# EasyEDA Pro project wireless-display-design.epro

# Schematic Wireless Tiny Display
Board Name: Board1; Create Date: 2025-10-23; Page Name: P1; Project Name: New Project_2025-10-23_18-24-38; Schematic Name: Wireless Tiny Display; Update Date: 2025-10-30; Company: EasyEDA.com; Page Size: A4; Version: V1.0
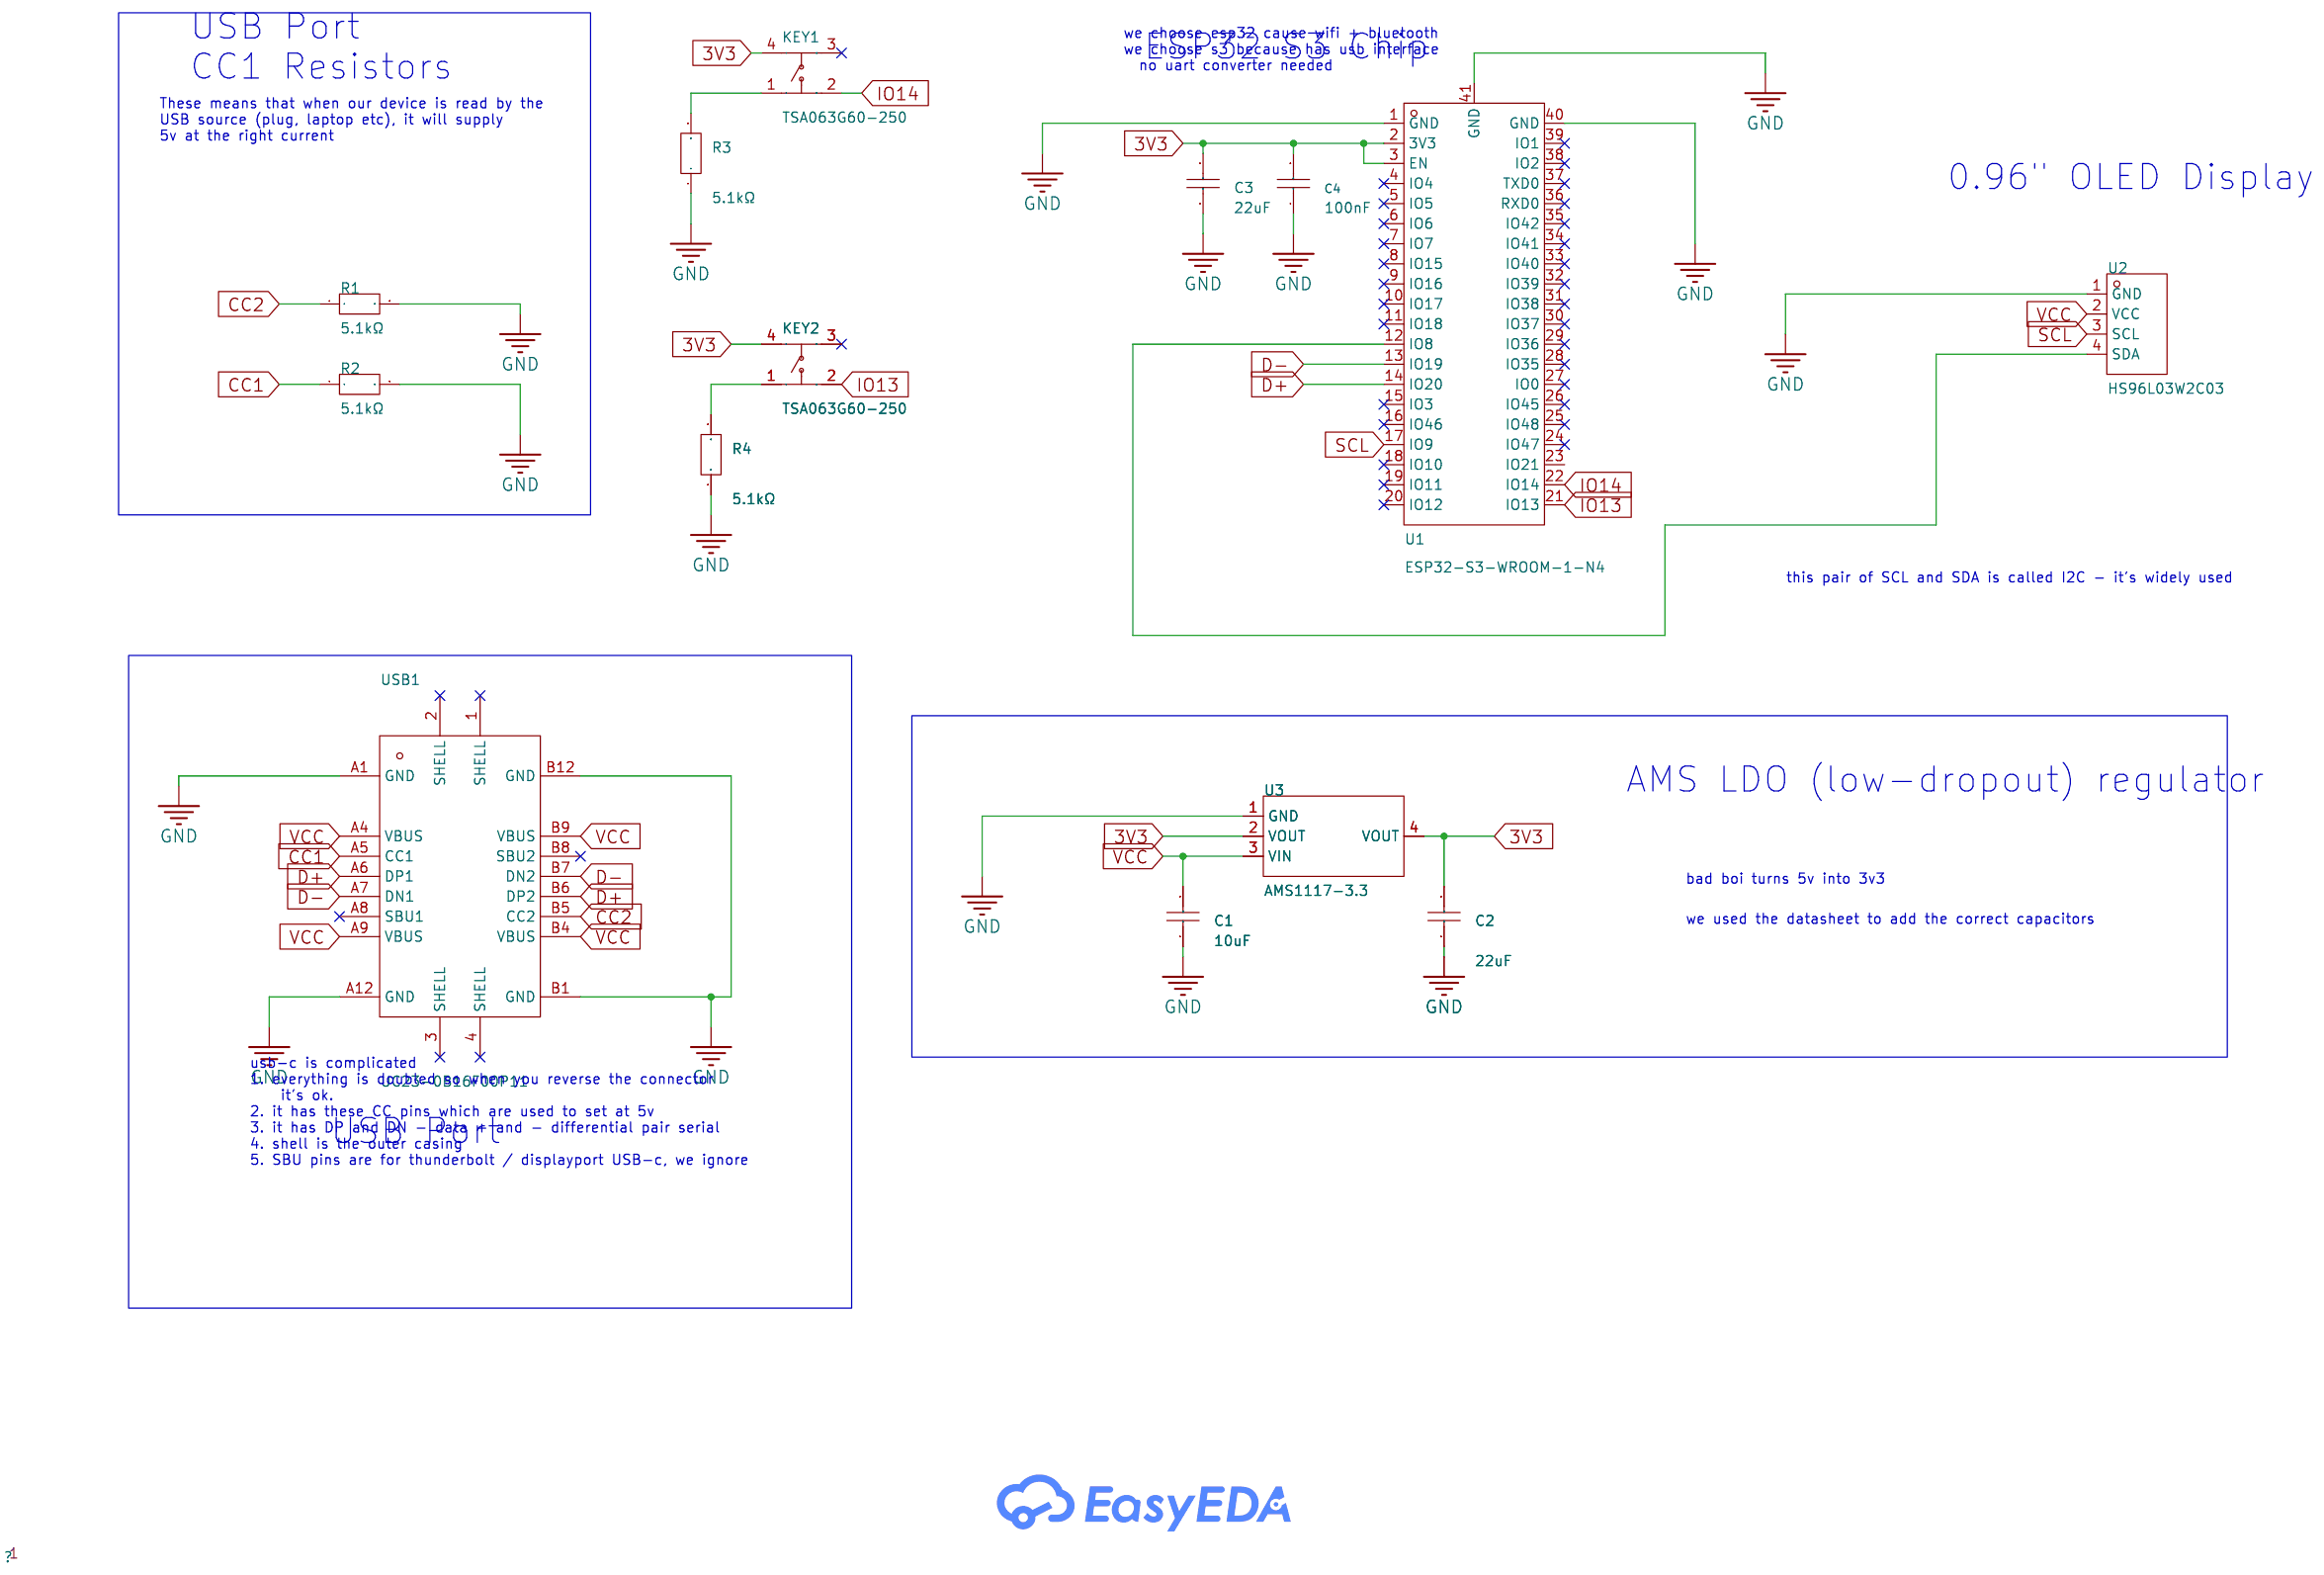
[diagram p0: schematic sheet]

## Parts
C1  10uF  [C1206]
C2  22uF  [C1206]
C3  22uF  [C1206]
C4  100nF  [C1206]
KEY1  TSA063G60-250  [KEY-SMD_4P-L6.1-W6.1-P4.50-LS9.0]
KEY2  TSA063G60-250  [KEY-SMD_4P-L6.1-W6.1-P4.50-LS9.0]
R1  5.1kΩ  [R1206]
R2  5.1kΩ  [R1206]
R3  5.1kΩ  [R1206]
R4  5.1kΩ  [R1206]
U1  ESP32-S3-WROOM-1-N4  [WIFIM-SMD_ESP32-S3-WROOM-1-N8]
U2  HS96L03W2C03  [OLED-TH_L27.8-W27.2-P2.54_C9900033791]
U3  AMS1117-3.3  [SOT-223-3_L6.5-W3.4-P2.30-LS7.0-BR]
USB1  UC23-0B16F00P11  [USB-C-TH_UC23-0B16F00P11]

## Library data of the parts
C1 = CL31A106KBHNNNE: Capacitance:10uF Tolerance:±10% Tolerance:±10% Voltage Rating:50V Temperature Coefficient:X5R; LCSC Part Name: 10uF ±10% 50V; Supplier Part: C13585; Manufacturer: SAMSUNG(三星); Supplier Footprint: 1206; JLCPCB Part Class: Basic Part; Datasheet: https://item.szlcsc.com/datasheet/CL31A106KBHNNNE/14236.html; Supplier: LCSC; Tolerance: ±10%; Voltage Rating: 50V; Temperature Coefficient: X5R
C2 C3 = CL31A226KAHNNNE: Capacitance:22uF Tolerance:±10% Tolerance:±10% Voltage Rating:25V Temperature Coefficient:X5R; LCSC Part Name: 22uF ±10% 25V; Supplier Part: C12891; Manufacturer: SAMSUNG(三星); Supplier Footprint: 1206; JLCPCB Part Class: Basic Part; Datasheet: https://item.szlcsc.com/datasheet/CL31A226KAHNNNE/13537.html; Supplier: LCSC; Tolerance: ±10%; Voltage Rating: 25V; Temperature Coefficient: X5R
C4 = CL31B104KBCNNNC: Capacitance:100nF Tolerance:±10% Tolerance:±10% Voltage Rating:50V Temperature Coefficient:X7R; LCSC Part Name: 100nF ±10% 50V; Supplier Part: C24497; Manufacturer: SAMSUNG(三星); Supplier Footprint: 1206; JLCPCB Part Class: Basic Part; Datasheet: https://item.szlcsc.com/datasheet/CL31B104KBCNNNC/25237.html; Supplier: LCSC; Tolerance: ±10%; Voltage Rating: 50V; Temperature Coefficient: X7R
KEY1 KEY2 = TSA063G60-250: Circuit:SPST Actuator Style:Round Button Operating Force:2.5N Mounting Type:Surface Mount,Vertical Length:6.1mm Width:6.1mm Switch Height:6mm with Bracket:Without Bracket Contact Current:50mA Voltage Rating:12V Actuator/Cap Color:Black With Lamp:No Termin; LCSC Part Name: 6.1*6.1*6mm 立贴 轻触开关; Supplier Part: C294566; Manufacturer: BRIGHT(博瑞泰); Supplier Footprint: SMD; JLCPCB Part Class: Extended Part; Datasheet: https://item.szlcsc.com/datasheet/TSA063G60-250/279063.html; Supplier: LCSC; Circuit: SPST; Actuator Style: Round Button; Operating Force: 2.5N; Mounting Type: Surface Mount,Vertical; Length: 6.1mm; Width: 6.1mm; Switch Height: 6mm; with Bracket: Without Bracket; Contact Current: 50mA; Voltage Rating: 12V; Actuator/Cap Color: Black; With Lamp: No; Termination Style: Gull Wing; Life: 50,000 Cycles; Operating Temperature: -25℃~+70℃
R1-R4 = FRC1206J512 TS: Type:Thick Film Resistor Resistance:5.1kΩ Tolerance:±5% Tolerance:±5% Power(Watts):250mW Voltage-Supply(Max):200V Temperature Coefficient:±100ppm/℃ Temperature Coefficient:±100ppm/℃ Operating Temperature:-55℃~+155℃ Operating Temperature:-55℃~+155℃; LCSC Part Name: 5.1kΩ ±5% 250mW 厚膜电阻; Supplier Part: C2907509; Manufacturer: FOJAN(富捷); Supplier Footprint: 1206; Supplier: LCSC; Type: Thick Film Resistor; Tolerance: ±5%; Power(Watts): 250mW; Voltage-Supply(Max): 200V; Temperature Coefficient: ±100ppm/℃; Operating Temperature: -55℃~+155℃
U1 = ESP32-S3-WROOM-1-N4: LCSC Part Name: 通用型Wi-Fi+低功耗蓝牙MCU模组; Supplier Part: C2913197; Manufacturer: ESPRESSIF(乐鑫); Supplier Footprint: SMD,18x25.5mm; JLCPCB Part Class: Extended Part; Datasheet: https://item.szlcsc.com/datasheet/ESP32-S3-WROOM-1-N4/3198295.html; Supplier: LCSC
U2 = HS96L03W2C03: Main Control Chip:SSD1315 Interface Type:I2C Size:0.96 Pixel Resolution:128x64 Operating Temperature:-40℃~+70℃ Operating Temperature:-40℃~+70℃; LCSC Part Name: 0.96寸OLED显示屏窄白光IIC; Supplier Part: C5248080; Manufacturer: HS(汉昇); JLCPCB Part Class: Extended Part; Datasheet: https://atta.szlcsc.com/upload/public/pdf/source/20230627/763D01F79A90007632F098068C7C8AD9.pdf; Supplier: LCSC; Main Control Chip: SSD1315; Interface Type: I2C; Size: 0.96; Pixel Resolution: 128x64; Operating Temperature: -40℃~+70℃
U3 = AMS1117-3.3_C6186: Output Type:Fixed Voltage - Supply:16V Output Voltage:3.3V Output Voltage:3.3V Output Current:1A Power Supply Rejection Ratio (PSRR):72dB@(120Hz) Voltage Dropout:1.1V@(800mA) standby current:5mA Noise:0.003%Vout Features:Over Current Protection；Over Tempe; LCSC Part Name: 输出3.3V 1A; Supplier Part: C6186; Manufacturer: AMS; Supplier Footprint: SOT-223; Datasheet: https://item.szlcsc.com/datasheet/AMS1117-3.3/6652.html; Supplier: LCSC; Output Type: Fixed; Voltage - Supply: 16V; Output Voltage: 3.3V; Output Current: 1A; Power Supply Rejection Ratio (PSRR): 72dB@(120Hz); Voltage Dropout: 1.1V@(800mA); standby current: 5mA; Noise: 0.003%Vout; Features: Over Current Protection；Over Temperature Protection; Operating Temperature: -40℃~+125℃; Output Configuration: Positive; Number of Outputs: 1
USB1 = UC23-0B16F00P11: Connector Type:Type-C Gender:Female Mounting Type:Right Angle Number of Contacts:16P Number of Ports:1 Operating Temperature:-45℃~+85℃ Operating Temperature:-45℃~+85℃; LCSC Part Name: USB Type-C 母座 弯插; Supplier Part: C36936564; Manufacturer: BXCONN(宝讯); Supplier Footprint: 弯插; JLCPCB Part Class: Extended Part; Datasheet: https://item.szlcsc.com/datasheet/UC23-0B16F00P11/38663640.html; Supplier: LCSC; Connector Type: Type-C; Gender: Female; Mounting Type: Right Angle; Number of Contacts: 16P; Number of Ports: 1; Operating Temperature: -45℃~+85℃

## Nets
3V3: C2.2 C3.2 C4.2 KEY1.4 KEY2.4 U1.2(3V3) U1.3(EN) U3.2(VOUT) U3.4(VOUT)
GND: C1.1 C2.1 C3.1 C4.1 R1.2 R2.2 R3.1 R4.1 U1.1(GND) U1.40(GND) U1.41(GND) U2.1(GND) U3.1(GND) USB1.A1(GND) USB1.A12(GND) USB1.B1(GND) USB1.B12(GND)
VCC: C1.2 U2.2(VCC) U3.3(VIN) USB1.A4(VBUS) USB1.A9(VBUS) USB1.B4(VBUS) USB1.B9(VBUS)
CC1: R2.1 USB1.A5(CC1)
CC2: R1.1 USB1.B5(CC2)
D+: U1.14(IO20) USB1.A6(DP1) USB1.B6(DP2)
D-: U1.13(IO19) USB1.A7(DN1) USB1.B7(DN2)
IO13: KEY2.2 U1.21(IO13)
IO14: KEY1.2 U1.22(IO14)
SCL: U1.17(IO9) U2.3(SCL)
$1N3352: U1.12(IO8) U2.4(SDA)
$1N4443: KEY1.1 R3.2
$1N4682: KEY2.1 R4.2

Not connected (* = marked no-connect by the designer): KEY1 3*; KEY2 3*; U1 4(IO4)* 5(IO5)* 6(IO6)* 7(IO7)* 8(IO15)* 9(IO16)* 10(IO17)* 11(IO18)* 15(IO3)* 16(IO46)* 18(IO10)* 19(IO11)* 20(IO12)* 23(IO21) 24(IO47)* 25(IO48)* 26(IO45)* 27(IO0)* 28(IO35)* 29(IO36)* 30(IO37)* 31(IO38)* 32(IO39)* 33(IO40)* 34(IO41)* 35(IO42)* 36(RXD0)* 37(TXD0)* 38(IO2)* 39(IO1)*; USB1 1(SHELL)* 2(SHELL)* 3(SHELL)* 4(SHELL)* A8(SBU1)* B8(SBU2)*

## Notes on the sheet
- ESP32 S3 Chip
- USB Port
  CC1 Resistors
- we choose esp32 cause wifi + bluetooth
  we choose s3 because has usb interface
    no uart converter needed
- These means that when our device is read by the
  USB source (plug, laptop etc), it will supply
  5v at the right current
- 0.96" OLED Display
- this pair of SCL and SDA is called I2C - it's widely used
- AMS LDO (low-dropout) regulator
- bad boi turns 5v into 3v3
- we used the datasheet to add the correct capacitors
- USB Port
- usb-c is complicated
  1. everything is doubled so when you reverse the connector
      it's ok.
  2. it has these CC pins which are used to set at 5v
  3. it has DP and DN - data + and - differential pair serial
  4. shell is the outer casing
  5. SBU pins are for thunderbolt / displayport USB-c, we ignore

# Board PCB2
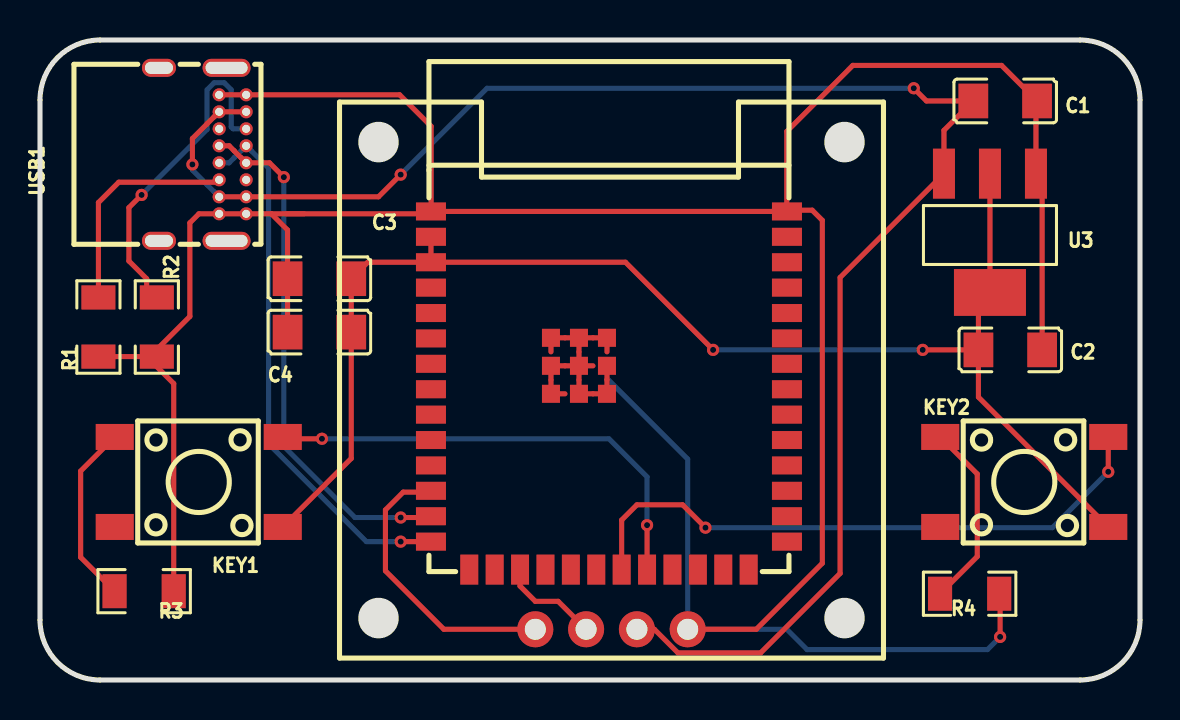
[diagram p1: board, top side]
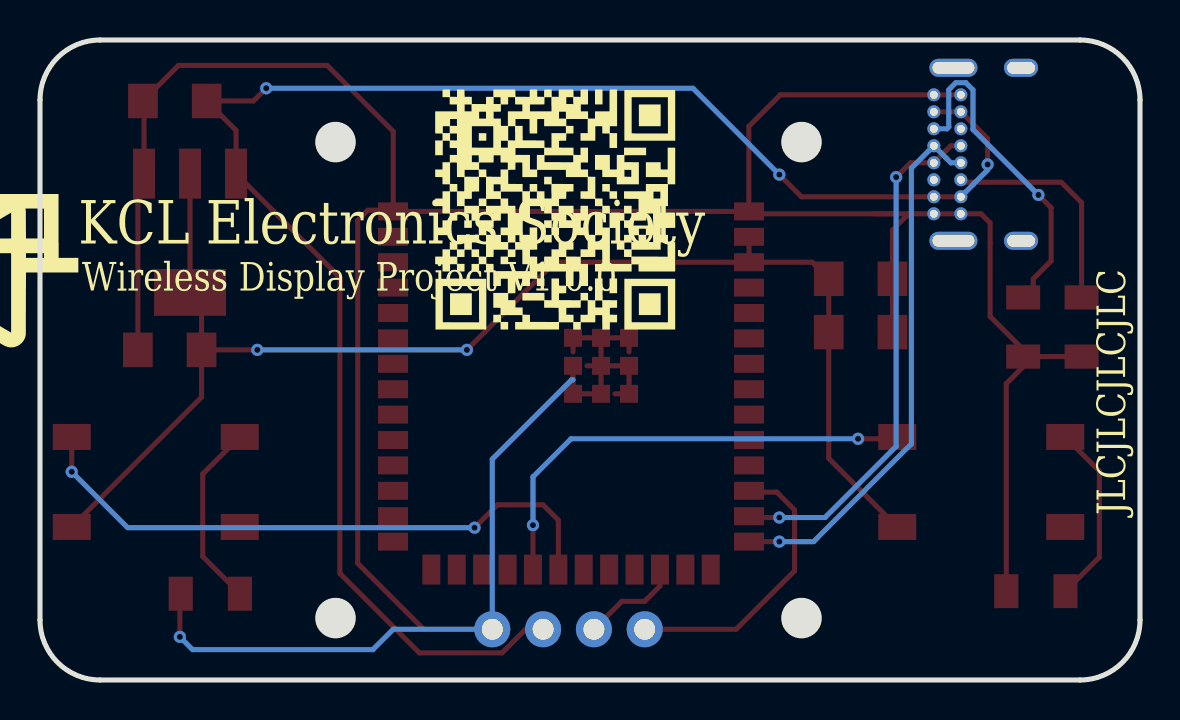
[diagram p2: board, bottom side, seen from below]

Outline 55 x 32 mm; copper layers: Top Layer, Bottom Layer. Coordinates in mm from the lower left corner of the outline.
Outline path: 0,29 0,3 arc(0.88,0.88) 3,0 52,0 arc(54.12,0.88) 55,3 55,29 arc(54.12,31.12) 52,32 3,32 arc(0.88,31.12) 0,29
Stack: Top Layer 0.035mm / Dielectric1 1.51mm FR4 er 4.5 / Bottom Layer 0.035mm

## Design rules (mm)
template: JLCPCB Capability(Two Layers Board)
spacing copperThickness1oz (default): track to track 0.102, other pairs 0.152 to 0.3
spacing copperThickness2oz: track to track 0.203, other pairs 0.152 to 0.3
track width copperThickness1oz (default): min 0.127, default 0.254, max 2.54
track width copperThickness2oz: min 0.203, default 0.254, max 2.54
differential pair differentialPair (default): width min 0.127, default 0.254, max 2.54; gap min 0.152, default 0.152
via viaSize (default): diameter min 0.5, default 0.61, max 10; hole min 0.3, default 0.305, max 6.3

## Placement (name value [footprint] x y rotation side)
C1  10uF  [C1206]  48.26 28.95 180 top
C2  22uF  [C1206]  48.51 16.51 180 top
C3  22uF  [C1206]  13.97 20.06 0 top
C4  100nF  [C1206]  13.97 17.39 0 top
KEY1  TSA063G60-250  [KEY-SMD_4P-L6.1-W6.1-P4.50-LS9.0]  7.94 9.9 0 top
KEY2  TSA063G60-250  [KEY-SMD_4P-L6.1-W6.1-P4.50-LS9.0]  49.21 9.9 0 top
R1  5.1kΩ  [R1206]  2.92 17.65 270 top
R2  5.1kΩ  [R1206]  5.84 17.65 270 top
R3  5.1kΩ  [R1206]  5.21 4.44 180 top
R4  5.1kΩ  [R1206]  46.48 4.31 180 top
U1  ESP32-S3-WROOM-1-N4  [WIFIM-SMD_ESP32-S3-WROOM-1-N8]  28.45 14.47 0 top
U2  HS96L03W2C03  [OLED-TH_L27.8-W27.2-P2.54_C9900033791]  28.58 2.54 180 top
U3  AMS1117-3.3  [SOT-223-3_L6.5-W3.4-P2.30-LS7.0-BR]  47.5 22.35 90 top
USB1  UC23-0B16F00P11  [USB-C-TH_UC23-0B16F00P11]  8.13 26.28 270 top

## Footprints (pads in the part's own frame, mm; a bottom-side part is the same pattern mirrored in y, then rotated)
C1206
  rect 1.485x1.728 smd: 1(-1.593,0) 2(1.593,0)
KEY-SMD_4P-L6.1-W6.1-P4.50-LS9.0
  rect 1.9x1.3 smd: 1(-4.2,2.25) 2(4.2,2.25) 3(-4.2,-2.25) 4(4.2,-2.25)
OLED-TH_L27.8-W27.2-P2.54_C9900033791
  round 1.8 hole 1.05: 1(-3.81,0) 2(-1.27,0) 3(1.27,0) 4(3.81,0)
R1206
  rect 1.208x1.701 smd: 1(-1.479,0) 2(1.479,0)
SOT-223-3_L6.5-W3.4-P2.30-LS7.0-BR
  rect 2.5x1.1 smd: 1(2.97,-2.3) 2(2.97,0) 3(2.97,2.3)
  rect 2.34x3.6 smd: 4(-2.97,0)
USB-C-TH_UC23-0B16F00P11
  oval 0.9x2.4 hole 0.6x2.1: 1(-4.325,1.2) 2(4.325,1.2)
  oval 0.9x1.7 hole 0.6x1.4: 3(4.325,-2.18) 4(-4.325,-2.18)
  round 0.65 hole 0.4: A1(-2.975,2.18) A4(-2.125,2.18) A5(-1.275,2.18) A6(-0.425,2.18) A7(0.425,2.18) A8(1.275,2.18) A9(2.125,2.18) A12(2.975,2.18) B1(2.975,0.83) B4(2.125,0.83) B5(1.275,0.83) B6(0.425,0.83) B7(-0.425,0.83) B8(-1.275,0.83) B9(-2.125,0.83) B12(-2.975,0.83)
WIFIM-SMD_ESP32-S3-WROOM-1-N8
  rect 1.5x0.9 smd: 1(-8.9,8.954) 2(-8.9,7.684) 3(-8.9,6.415) 4(-8.9,5.144) 5(-8.9,3.874) 6(-8.9,2.604) 7(-8.9,1.335) 8(-8.9,0.065) 9(-8.9,-1.206) 10(-8.9,-2.475) 11(-8.9,-3.745) 12(-8.9,-5.016) 13(-8.9,-6.285) 14(-8.9,-7.556) 27(8.9,-7.556) 28(8.9,-6.285) 29(8.9,-5.016) 30(8.9,-3.745) 31(8.9,-2.475) 32(8.9,-1.206) 33(8.9,0.065) 34(8.9,1.335) 35(8.9,2.604) 36(8.9,3.874) 37(8.9,5.144) 38(8.9,6.415) 39(8.9,7.684) 40(8.9,8.954)
  rect 0.9x1.5 smd: 15(-6.985,-8.954) 16(-5.715,-8.954) 17(-4.445,-8.954) 18(-3.175,-8.954) 19(-1.905,-8.954) 20(-0.635,-8.954) 21(0.635,-8.954) 22(1.905,-8.954) 23(3.175,-8.954) 24(4.445,-8.954) 25(5.715,-8.954) 26(6.985,-8.954)
  rect 0.9x0.9 smd: 41(-2.9,2.635) 41(-2.9,1.235) 41(-2.9,-0.165) 41(-1.5,2.635) 41(-1.5,1.235) 41(-1.5,-0.165) 41(-0.1,2.635) 41(-0.1,1.235) 41(-0.1,-0.165)

## Nets
As in the schematic.

Pads without a net: KEY1 3; KEY2 3; U1 4 5 6 7 8 9 10 11 15 16 18 19 20 23 24 25 26 27 28 29 30 31 32 33 34 35 36 37 38 39; USB1 1 2 3 4 A8 B8

## Via types
v1: diameter 0.61, hole 0.305, Top Layer to Bottom Layer, 14 vias

## Routing (per net, layer and track width the routed paths; a pad name or vN(x,y) marks a point on that pad's centre or on a via; arc(x,y) is an arc through that point)
3V3: length 69.2
  Top Layer w0.254: KEY1.4 15.56,11.08 C4.2 C3.2 16.39,20.89 U1.3 ; KEY2.4 46.92,14.14 C2.2 ; C2.2 v1(44.14,16.51) ; C2.2 46.92,18.8 U3.4 U3.2 ; U1.3 U1.2 ; U1.3 29.27,20.89 v1(33.66,16.51)
  Bottom Layer w0.254: v1(44.14,16.51) v1(33.66,16.51)
GND: length 162.5
  Top Layer w0.254: 11.57,23.31 13.21,23.31 ; 11.57,23.31 USB1.A12 ; 11.57,23.31 12.38,22.5 C3.1 C4.1 ; U1.41 U1.41 28.35,16.41 ; U1.41 U1.41 ; U1.41 U1.41 25.55,16.41 ; U1.41 U1.41 U1.41 U1.41 ; U1.41 U1.41 U1.41 26.25,14.31 ; U1.41 27.65,15.71 ; v1(48.01,2.16) 48.01,4.27 47.96,4.31 ; 7.49,21.84 7.49,22.86 7.95,23.31 USB1.B1 ; U1.40 U1.1 19.56,23.44 19.56,27.68 17.98,29.26 USB1.A1 USB1.B12 ; R3.1 6.69,14.82 5.33,16.17 ; C2.1 50.11,25.01 U3.1 49.8,28.9 C1.1 48.07,30.73 40.64,30.73 37.34,27.43 37.34,23.44 37.39,23.49 38.61,23.49 39.12,22.98 39.12,5.84 35.81,2.54 U2.1
  Bottom Layer w0.254: 28.35,15.01 28.42,15.01 32.39,11.05 U2.1 37.34,2.54 38.35,1.52 47.37,1.52 v1(48.01,2.16)
VCC: length 85.6
  Top Layer w0.254: v1(43.69,29.59) 44.32,28.95 C1.2 45.2,27.48 U3.3 40.01,20.12 40.01,5.33 36.03,1.36 31.9,1.36 30.72,2.54 U2.2 ; v1(7.62,25.78) 7.62,27.07 8.35,27.81 8.35,27.81 8.71,28.16 8.71,28.16 USB1.B9 USB1.A4 ; v1(18.03,25.27) 16.92,24.16 USB1.A9 USB1.B4
  Bottom Layer w0.254: v1(18.03,25.27) 22.35,29.59 v1(43.69,29.59) ; v1(7.62,25.78) 7.62,25.5 8.35,24.76 8.35,24.76 8.71,24.41 8.71,24.41 USB1.B4
CC1: length 16.5
  Top Layer w0.254: v1(5.08,24.25) 4.45,23.62 4.45,20.95 5.33,20.06 5.33,19.13
  Bottom Layer w0.254: USB1.A5 9.65,27.56 9.56,27.65 9.56,29.51 9.21,29.86 8.71,29.86 8.35,29.51 8.35,27.53 v1(5.08,24.25)
CC2: length 11.3
  Top Layer w0.254: 8.96,25.01 8.84,24.89 3.94,24.89 2.92,23.87 R1.1
D+: length 27.2
  Top Layer w0.254: U1.14 v1(18.03,6.92)
  Bottom Layer w0.254: v1(18.03,6.92) 16.32,6.92 11.43,11.81 11.43,25.59 10.56,26.46 10.55,26.46 USB1.A6 10.06,26.46 10.06,26.46 9.7,26.11 9.7,26.11 9.46,25.86 USB1.B6
D-: length 26.2
  Top Layer w0.254: v1(12.19,25.14) 11.47,25.86 USB1.A7 10.06,26.11 10.06,26.11 9.7,26.46 9.7,26.46 9.46,26.71 USB1.B7 ; U1.13 19.48,8.12 v1(18.03,8.12)
  Bottom Layer w0.254: v1(18.03,8.12) 15.75,8.12 12.19,11.68 v1(12.19,25.14)
IO13: length 30.5
  Top Layer w0.254: v1(33.27,7.62) 32.13,8.76 29.85,8.76 29.08,8 29.08,5.52 ; KEY2.2 v1(53.41,10.41)
  Bottom Layer w0.254: v1(53.41,10.41) 50.62,7.62 v1(33.27,7.62)
IO14: length 23.7
  Top Layer w0.254: KEY1.2 12.23,12.06 v1(14.1,12.06) ; U1.22 v1(30.35,7.74)
  Bottom Layer w0.254: v1(30.35,7.74) 30.35,10.16 28.45,12.06 v1(14.1,12.06)
SCL: length 5
  Top Layer w0.254: U2.3 25.91,3.93 24.77,3.93 24,4.69 U1.17
$1N3352: length 14.4
  Top Layer w0.254: U2.4 20.19,2.54 17.27,5.46 17.27,8.5 18.16,9.39 19.48,9.39 U1.12
$1N4443: length 9.1
  Top Layer w0.254: KEY1.1 2.03,10.45 2.03,6.14 R3.2
$1N4682: length 9.4
  Top Layer w0.254: KEY2.1 46.86,10.3 46.86,6.17 R4.2

## Text on the board
Bottom Silkscreen Layer: Wireless Display Project V1.0.0 | JLCJLCJLCJLC | KCL Electronics Society
